# Altium schematic sheet 02.SchDoc
size 420 x 297 mm
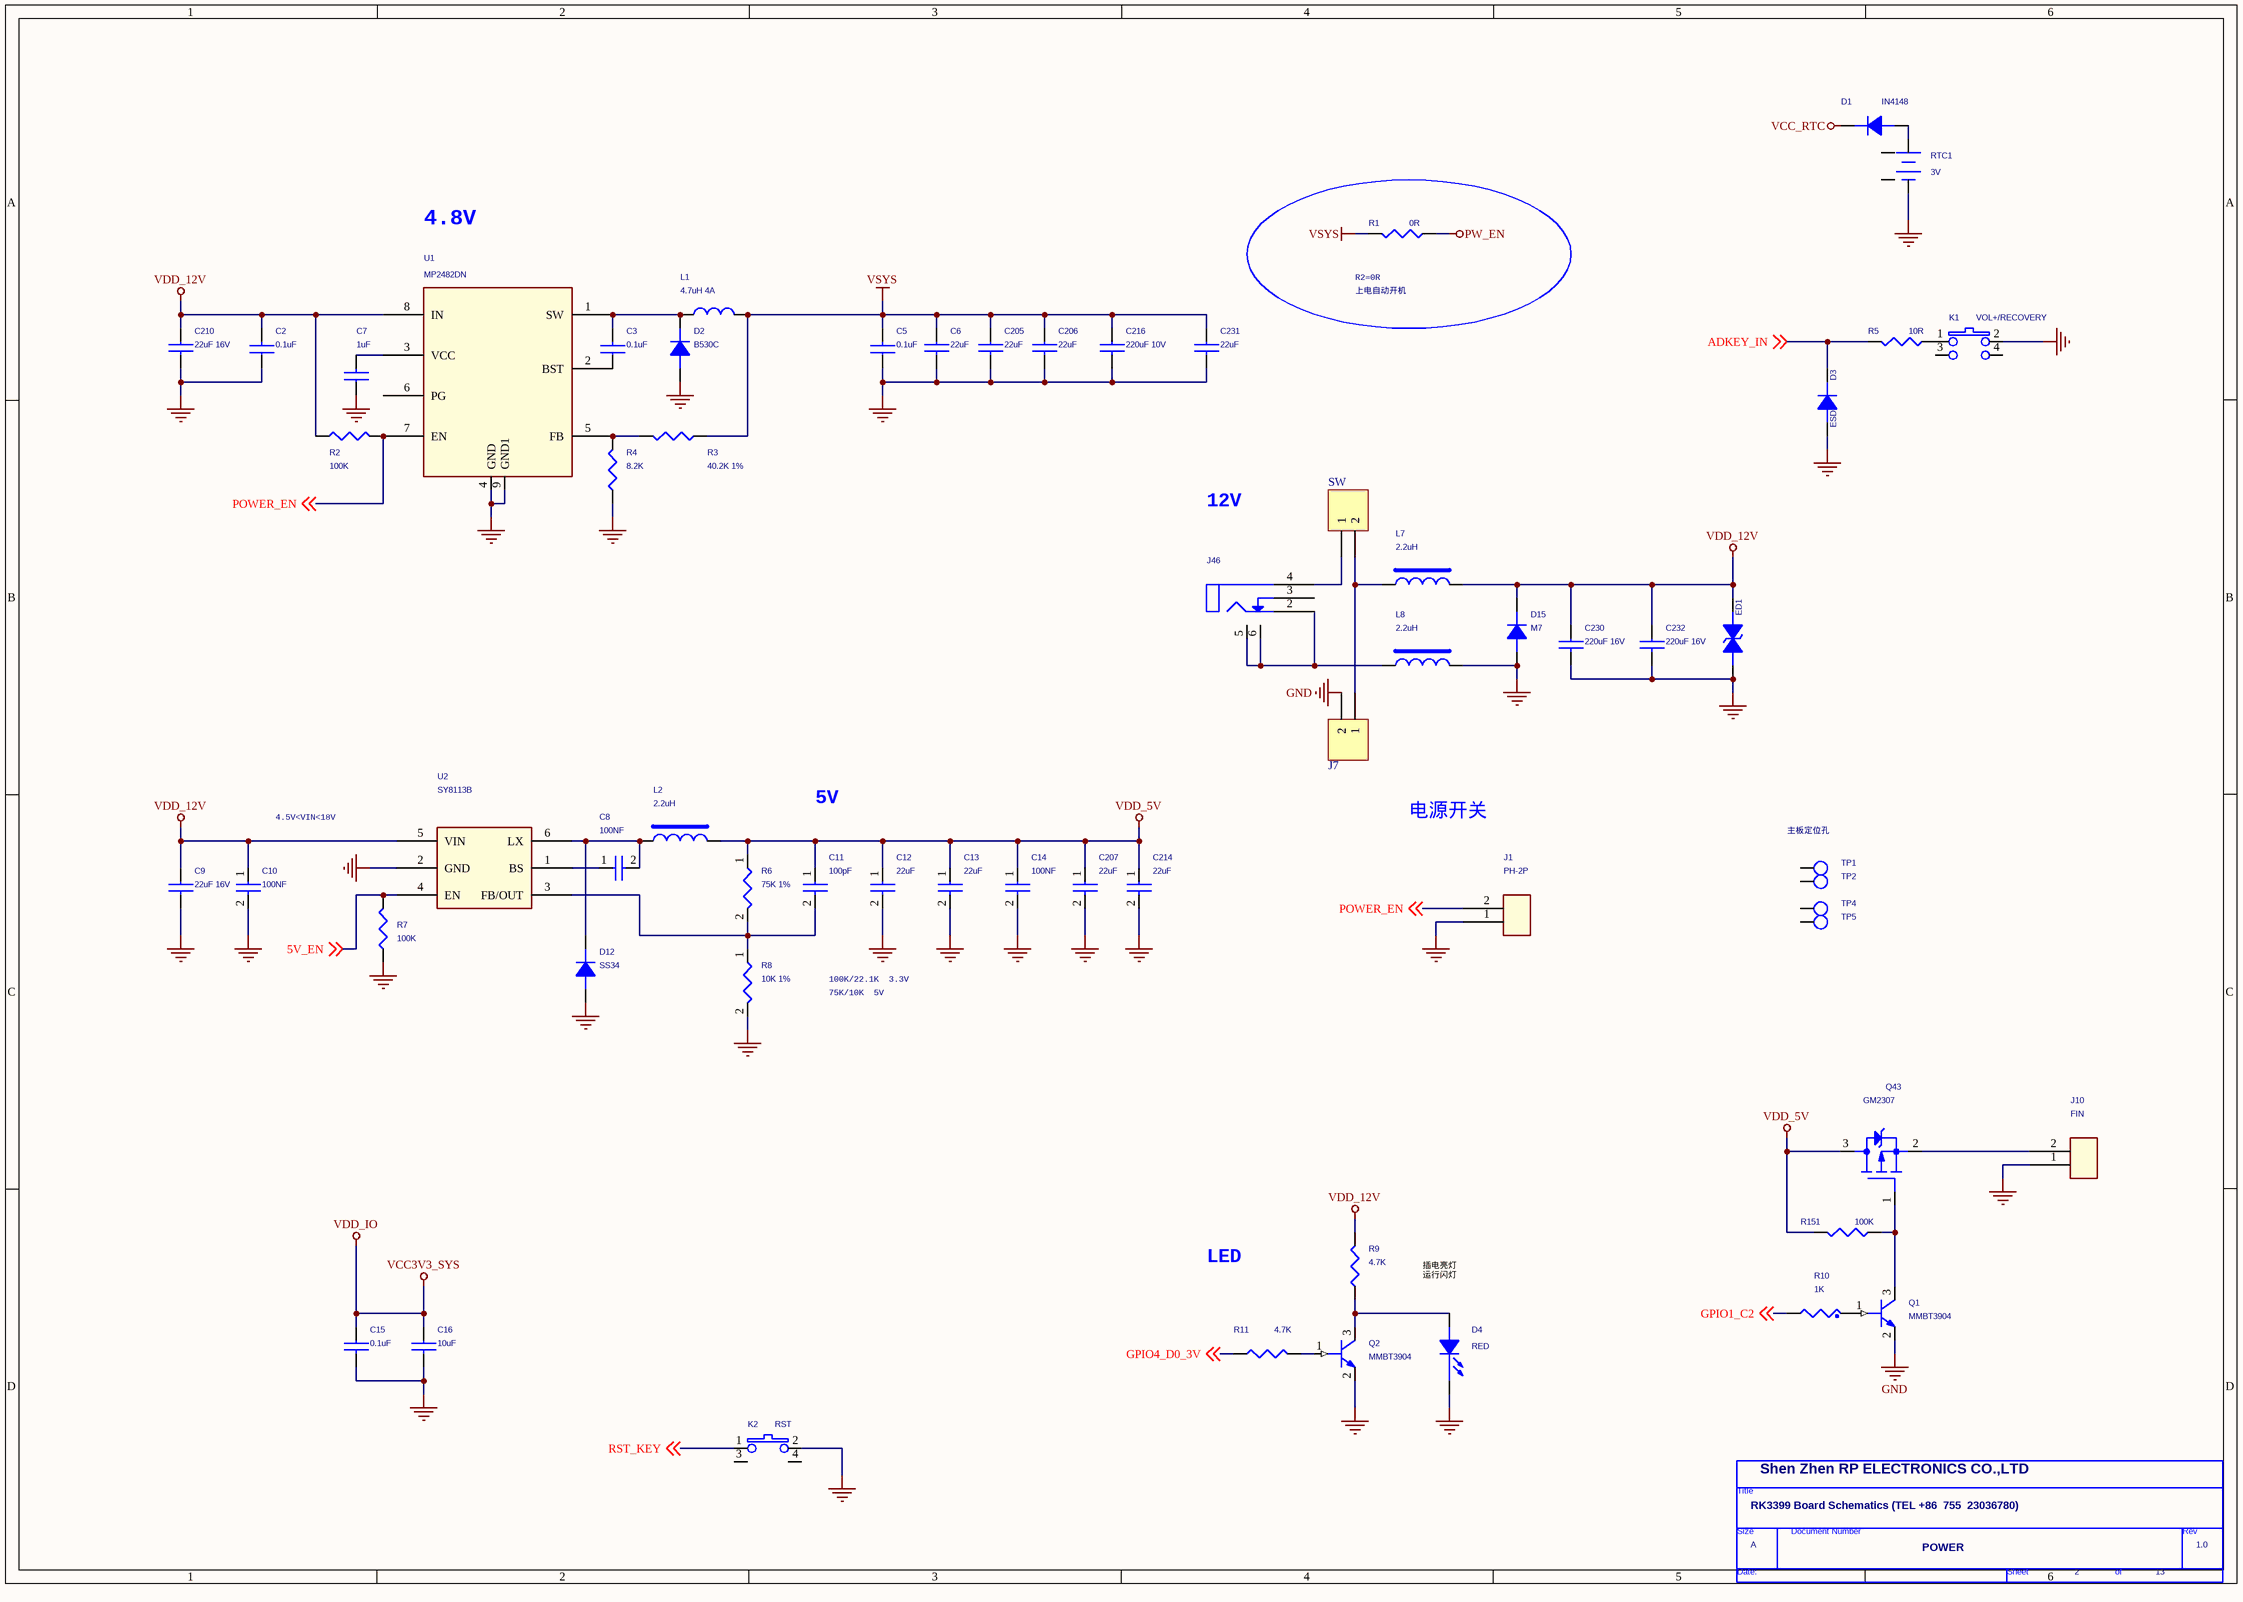
[diagram p0: 02.SchDoc]

## Parts
*  Doc: POWER  RevCode: 1.0  Title: RK3399 Board Schematics (TEL +86  755  23036780)  Page Size: A  Page Number: 2  Page Count: 13  Cage Code: Shen Zhen RP ELECTRONICS CO.,LTD  (hidden comment: TitleBlock0)  (graphical)
C2  0.1uF  [0805c]
C3  0.1uF  [0805C]
C5  0.1uF  [0805C]
C6  22uF  [0805C]
C7  1uF  [0805C]
C8  100NF  [0805C]
C9  22uF 16V  [3216C]
C10  100NF  [0805C]
C11  100pF  [0805C]
C12  22uF  [0805C]
C13  22uF  [0805C]
C14  100NF  [0805C]
C15  0.1uF  [0805C]
C16  10uF  [0805C]
C205  22uF  [0805C]
C206  22uF  [0805C]
C207  22uF  [0805C]
C210  22uF 16V  [3216c]
C214  22uF  [0805C]
C216  220uF 10V  [CASE-B]
C230  220uF 16V  [CAP-6X6]
C231  22uF  [0805C]
C232  220uF 16V  [CAP-6X6]
D1  IN4148  [SOD-323]
D2  B530C  [DO-214AB]
D3  ESD  [0805d]
D4  RED  [LED0805]
D12  SS34  [DO-214AC]
D15  M7  [DO-214AC]
ED1  ESD  [SOD-323]  (value not drawn)
J1  PH-2P  [SIP-2P-2D0]
J7  Header 2  [VH3.96*2]  (value not drawn)
J10  FIN  [SIP-2P-2D0]
J46  DC_5V  [DC044A]  (value not drawn)
K1  VOL+/RECOVERY  [KEYB]
K2  RST  [KEYB]
L1  4.7uH 4A  [VLS252012E]
L2  2.2uH  [l5d18]
L7  2.2uH  [l5d18]
L8  2.2uH  [l5d18]
Q1  MMBT3904  [SOT-23]
Q2  MMBT3904  [SOT-23]
Q43  GM2307  [SOT-23]
R1  0R  [0805]
R2  100K  [0805]
R3  40.2K 1%  [0805]
R4  8.2K  [0805]
R5  10R  [0805]
R6  75K 1%  [0805]
R7  100K  [0805]
R8  10K 1%  [0805]
R9  4.7K  [0805]
R10  1K  [0805]
R11  4.7K  [0805]
R151  100K  [0805]
RTC1  3V  [12505WR2]
SW  Header 2  [VH3.96*2]  (value not drawn)
TP1  T POINT R  [SCREW]  (value not drawn)
TP2  T POINT R  [SCREW]  (value not drawn)
TP4  T POINT R  [SCREW]  (value not drawn)
TP5  T POINT R  [SCREW]  (value not drawn)
U1  MP2482DN  [SO-8-A]
U2  SY8113B  [SOT23-6]

## Nets
GND: C2.1 C5.1 C6.2 C7.1 C9.2 C10.2 C12.2 C13.2 C14.2 C15.2 C16.2 C205.2 C206.2 C207.2 C210.2 C214.2 C216.2 C230.2 C231.2 C232.2 D2.1(A) D3.1(A) D4.2(CATHODE) D12.1(A) D15.1(A) ED1.2(K) J1.1 J7.2 J10.1 K1.2 K2.2 L8.2 Q1.2(EMITTER) Q2.2(EMITTER) R4.2 R7.1 R8.2 RTC1.2(-) U1.4(GND) U1.9(GND1) U2.2(GND)
PW_EN: R1.1
VCC3V3_SYS: C15.1 C16.1  [also labelled VDD_IO]
VCC_RTC: D1.2(K)
VDD_5V: C11.1 C12.1 C13.1 C14.1 C207.1 C214.1 L2.2 Q43.3(D) R6.1 R151.1
VDD_12V: C2.2 C9.1 C10.1 C210.1 C230.1 C232.1 D15.2(K) ED1.1(A) L7.2 R2.1 R9.1 U1.8(IN) U2.5(VIN)
VSYS: C5.2 C6.1 C205.1 C206.1 C216.1 C231.1 L1.2 R1.2 R3.2
5V_EN: R7.2 U2.4(EN) ; off-sheet 5V_EN
ADKEY_IN: D3.2(K) R5.1 ; off-sheet ADKEY_IN
GPIO1_C2: R10.2 ; off-sheet GPIO1_C2
GPIO4_D0_3V: R11.1 ; off-sheet GPIO4_D0_3V
POWER_EN: J1.2 R2.2 U1.7(EN) ; off-sheet POWER_EN
RST_KEY: K2.1 ; off-sheet RST_KEY
NetC3_1: C3.1 U1.2(BST)
NetC3_2: C3.2 D2.2(K) L1.1 U1.1(SW)
NetC7_2: C7.2 U1.3(VCC)
NetC8_1: C8.1 U2.1(BS)
NetC8_2: C8.2 D12.2(K) L2.1 U2.6(LX)
NetC11_2: C11.2 R6.2 R8.1 U2.3(FB/OUT)
NetD1_1: D1.1(A) RTC1.1(+)
NetD4_1: D4.1(ANODE) Q2.3(COLLECT) R9.2
NetJ7_1: J7.1 L7.1 SW.2
NetJ10_2: J10.2 Q43.2(S)
NetJ46_2: J46.2 J46.5 J46.6 L8.1
NetJ46_4: J46.4 SW.1
NetK1_1: K1.1 R5.2
NetQ1_1: Q1.1(BASE) R10.1
NetQ1_3: Q1.3(COLLECT) Q43.1(G) R151.2
NetQ2_1: Q2.1(BASE) R11.2
NetR3_1: R3.1 R4.1 U1.5(FB)

Not connected (* = marked no-connect by the designer): J46 3; K1 3 4; K2 3 4; RTC1 3 4; TP1 1(TP); TP2 1(TP); TP4 1(TP); TP5 1(TP); U1 6(PG)

## Notes on the sheet
- 4.8V
- (near R1) R2=0R
- 上电自动开机
- 12V
- 4.5V<VIN<18V
- 5V
- 电源开关
- 主板定位孔
- 100K/22.1K  3.3V
- 75K/10K  5V
- LED
- 插电亮灯
  运行闪灯
- (in symbol TitleBlock0) Title; Size; Document Number; Rev; Date:; Sheet; of

## Library data of the parts
C2 C3 C5 C7 = C1005_0
C6 C16 C205 C206 C231 = CAP NP_3: CAP,MLCC,100nF,+/-10%,X7R,6.3V,SMD0402
C8 = CAP NP_Dup2: cap,100.00nF,+/-10%,25V,X5R,C0402; Manufacturer PN: C1005X5R1E104K050BC; Manufacturer: TDK; Tolerance: 10%; Priority: A; Voltage: 25V; Dielectric: X5R; Created by: JJJ; Part Type: C0402; RK PN: C1005X5R1E104K050BC
C9 C210 C216 C230 C232 = CAP NP_Dup8
C10 = CAP NP_Dup2: cap,100.00nF,+/-10%,25V,X5R,C0402; Manufacturer: TDK; RK PN: C1005X5R1E104K050BC; Priority: A; Tolerance: 10%; Voltage: 25V; Dielectric: X5R; Part Type: C0402; Manufacturer PN: C1005X5R1E104K050BC; Created by: JJJ
C11 = CAP NP_Dup2: cap,100.00pF,+/-5%,50V,C0G,C0402; Manufacturer: TDK; RK PN: C1005C0G1H101J050BA; Priority: A; Tolerance: 5%; Voltage: 50V; Dielectric: C0G; Part Type: C0402; Manufacturer PN: C1005C0G1H101J050BA; Created by: JJJ
C12 C207 C214 = CAP NP_Dup2: cap,22.00uF,+/-10%,10V,X5R,C0805; Manufacturer: TDK; RK PN: C2012X5R1A226K125AB; Priority: A; Tolerance: 10%; Voltage: 10V; Dielectric: X5R; Part Type: C0805; Manufacturer PN: C2012X5R1A226K125AB; Created by: JJJ
C13 = CAP NP_Dup2: cap,10.00uF,+/-10%,10V,X5R,C0805; Manufacturer: TDK; RK PN: C2012X5R1A106K125AB; Priority: A; Tolerance: 10%; Voltage: 10V; Dielectric: X5R; Part Type: C0805; Manufacturer PN: C2012X5R1A106K125AB; Created by: JJJ
C14 = CAP NP_Dup2: cap,100.00nF,+/-10%,16V,X5R,C0402; Manufacturer: TDK; RK PN: C1005X5R1C104K050BA; Priority: A; Tolerance: 10%; Voltage: 16V; Dielectric: X5R; Part Type: C0402; Manufacturer PN: C1005X5R1C104K050BA; Created by: JJJ
C15 = 02CAPP
D1 D3 = DIODE_Dup2
D2 D12 D15 = DIODE_Dup1
D4 = LED
ED1 = DIODE BI-DIR TRIG
J1 = CON2
J7 SW = Header 2: Header, 2-Pin; LatestRevisionDate: 17-Jul-2002; LatestRevisionNote: Re-released for DXP Platform.; Publisher: Altium Limited
J10 = CON4_0_Dup1
J46 = CONN JACK PWR_0_Dup1
K1 = KEYB_0
K2 = KEYB_1
L1 = VLS252012E_0
L2 L7 = INDUCTORS OF FERRITE: Power Inductor,3.3uH,0.2,IND_404030; Manufacturer: sunlord; DC Resistor: 0.04ohm; Isat: 3.3A; RK PN: SWPA4030S3R3MT; Priority: A; Tolerance: 20%; Irms: 2.4A; Resonace frequency: 38M; Part Type: POWER_IND; Manufacturer PN: SWPA4030S3R3MT; Created by: YTL
L8 = INDUCTORS OF FERRITE: Power Inductor,3.3uH,0.2,IND_404030; Manufacturer PN: SWPA4030S3R3MT; Manufacturer: sunlord; DC Resistor: 0.04ohm; Isat: 3.3A; Resonace frequency: 38M; Irms: 2.4A; Tolerance: 20%; Priority: A; Created by: YTL; Part Type: POWER_IND; RK PN: SWPA4030S3R3MT
Q1 Q2 = NPN_1
Q43 = APM2301
R1 R7 R11 = R_Dup1
R2 = RESISTOR_5: 通用厚膜电阻,10K,+/-5%,R0402,1/16W.; Manufacturer PN: RC0402JR-0710KL; Manufacturer: YAGEO; Tolerance: 5%; Wattage: 1/16W; Priority: A; Created by: YTL; Part Type: 通用厚膜电阻; RK PN: RC0402JR-0710KL
R3 R4 R9 R151 = R1005_0_Dup1
R5 = RES 1B: ROHS CHIP RES 4.7Ohm 1/8W +/-5%
R6 = RESISTOR_Dup1: 通用厚膜电阻,75K,+/-1%,R0402,1/16W.; Manufacturer: YAGEO; RK PN: RC0402FR-0775KL; Priority: A; Wattage: 1/16W; Tolerance: 1%; Part Type: 通用厚膜电阻; Manufacturer PN: RC0402FR-0775KL; Created by: YTL
R8 = RESISTOR_Dup1: 通用厚膜电阻,10K,+/-1%,R0402,1/16W.; Manufacturer PN: RC0402FR-0710KL; Manufacturer: YAGEO; Wattage: 1/16W; Priority: A; Tolerance: 1%; Created by: YTL; Part Type: 通用厚膜电阻; RK PN: RC0402FR-0710KL
R10 = RES: RES MF 10.0K 1/16W 1% 0402; CLASS: DISCRETE; SIGNAL_MODEL: DEFAULT_RESISTOR_10000OHM_2_1; FPLIST: RC0402_25,RC0402_HD,0402_CC; CAD_APPROVED: Yes; MFG_PN01: CRCW040210K0FKED; MFG_NAME01: VISHAY INTERTECHNOLOGY; AGILE_PN: 470-75416; ROHS: Yes; Tolerance: 1%
RTC1 = BATTERY_5
U1 = MP2482DN_1
U2 = DCDC_SY8113: Manufacturer: Silergy（矽力杰）; Priority: A; RK PN: SY8113B; Part Type: DCDC; Manufacturer PN: SY8113B; Created by: JJJ
* = TitleBlock0: Page Create Date: March  8, 1995